# Altium schematic sheet 智能家居图纸2.SchDoc
size A4; SheetNumber: 2; SheetTotal: 2; SPICEModelCacheMWUIDHTT: <root> / <DocumentId>MWUIDHTT</DocumentId> / <CacheFrame Number="0"> / <Model Name="led0" Kind="MDL"> / <Text>*Typ INFRARED GaAs LED: Vf=1.2V Vr=5V If=40mA trr=3uS / *LED Pinout: 1=A, 2=K / .MODEL LED0 D (IS=93.5P RS=84M N=2.63 BV=5 IBV=10U / + CJO=2.97P VJ=.75 M=.333 TT=4.32U)</Text> / </Model> / <Model Name="led1" Kind="MDL"> / <Text>*Typ RED GaAs LED: Vf=1.7V Vr=4V If=40mA trr=3uS / *LED Pinout: 1=A, 2=K / .MODEL LED1 D (IS=93.2P RS=42M N=3.73 BV=4 IBV=10U / + CJO=2.97P VJ=.75 M=.333 TT=4.32U)</Text> / </Model> / <Model Name="led2" Kind="MDL"> / <Text>*Typ RED,GREEN,YELLOW,AMBER GaAs LED: Vf=2.1V Vr=4V If=40mA trr=3uS / *LED Pinout: 1=A, 2=K / .MODEL LED2 D (IS=93.1P RS=42M N=4.61 BV=4 IBV=10U / + CJO=2.97P VJ=.75 M=.333 TT=4.32U)</Text> / </Model> / <Model Name="led3" Kind="MDL"> / <Text>*Typ BLUE SiC LED: Vf=3.4V Vr=5V If=40mA trr=3uS / *LED Pinout: 1=A, 2=K / .MODEL LED3 D (IS=93.1P RS=42M N=7.47 BV=5 IBV=30U / + CJO=2.97P VJ=.75 M=.333 TT=4.32U)</Text> / </Model> / </CacheFrame> / </root>
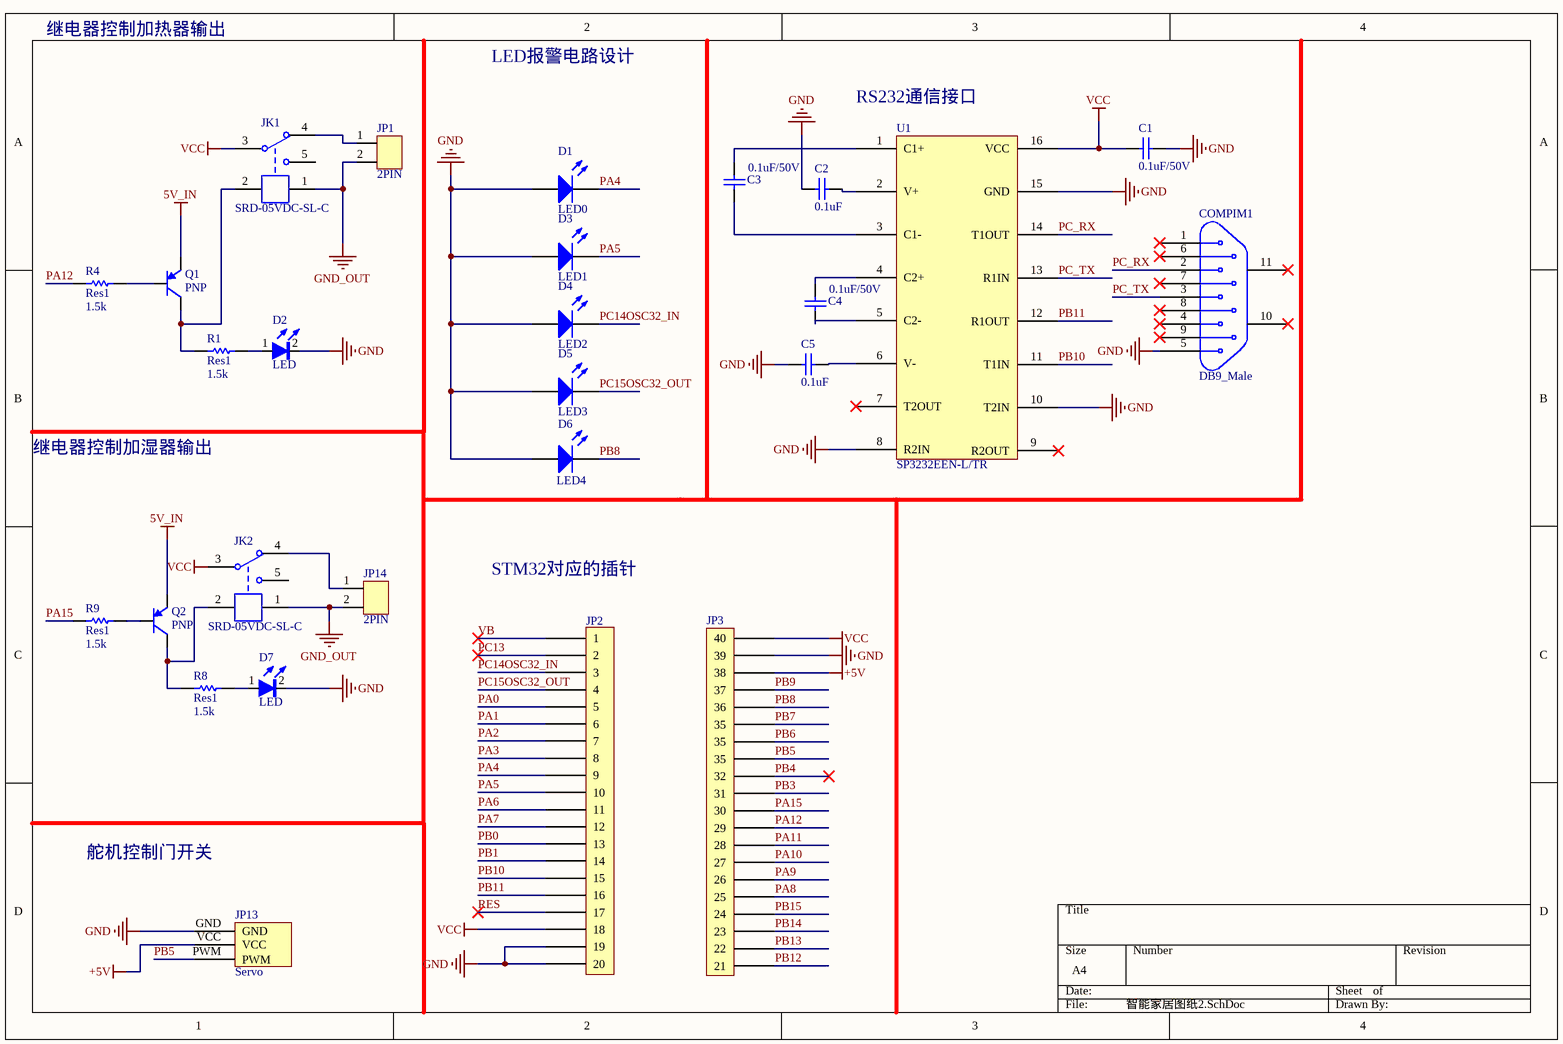
[diagram p0: 智能家居图纸2.SchDoc]

## Parts
C1  value 0.1uF/50V  [C0603]  (hidden comment: Cap)
C2  value 0.1uF  [C0603]  (hidden comment: Cap)
C3  value 0.1uF/50V  [C0603]  (hidden comment: Cap)
C4  value 0.1uF/50V  [C0603]  (hidden comment: Cap)
C5  value 0.1uF  [C0603]  (hidden comment: Cap)
COMPIM1  DB9_Male  [DB9Male]
D1  LED0  [LED-Green]
D2  LED  [LED-Green]
D3  LED1  [LED-Red]
D4  LED2  [LED-White]
D5  LED3  [LED-yellow]
D6  LED4  [LED-yellow]
D7  LED  [LED-Red]
JK1  SRD-05VDC-SL-C  [SRD-C_B]
JK2  SRD-05VDC-SL-C  [SRD-C_B]
JP1  2PIN  [2PIN]
JP2  JP3  [HDR1X20]  (value not drawn)
JP3  JP4  [HDR1X20-2]  (value not drawn)
JP13  Servo  [HDR1X3-5]
JP14  2PIN  [2PIN]
Q1  PNP  [PNP]
Q2  PNP  [PNP]
R1  Res1  value 1.5k  [R200]
R4  Res1  value 1.5k  [R200]
R8  Res1  value 1.5k  [R200]
R9  Res1  value 1.5k  [R200]
U1  SP3232EEN-L/TR  [SOP127P600X175-16N]

## Nets
5V_IN: Q1.3(E) Q2.3(E)
+5V: JP3.38 JP13.VCC
GND: C1.1 C2.1 C5.1 COMPIM1.5 D1.1(A) D2.2 D3.1(A) D4.1(A) D5.1(A) D6.1(A) D7.2 JP2.19 JP2.20 JP3.39 JP13.GND U1.8(R2IN) U1.10(T2IN) U1.15(GND)
GND_OUT: JK1.1 JK2.1 JP1.2 JP14.2
VCC: C1.2 JK1.3 JK2.3 JP2.18 JP3.40 U1.16(VCC)
PA0: JP2.5
PA1: JP2.6
PA2: JP2.7
PA3: JP2.8
PA4: D1.2(K) JP2.9
PA5: D3.2(K) JP2.10
PA6: JP2.11
PA7: JP2.12
PA8: JP3.25
PA9: JP3.26
PA10: JP3.27
PA11: JP3.28
PA12: JP3.29 R4.2
PA15: JP3.30 R9.2
PB0: JP2.13
PB1: JP2.14
PB3: JP3.31
PB4: JP3.32
PB5: JP3.33(35) JP13.PWM
PB6: JP3.34(35)
PB7: JP3.35
PB8: D6.2(K) JP3.36
PB9: JP3.37
PB10: JP2.15 U1.11(T1IN)
PB11: JP2.16 U1.12(R1OUT)
PB12: JP3.21
PB13: JP3.22
PB14: JP3.23
PB15: JP3.24
PC13: JP2.2
PC14OSC32_IN: D4.2(K) JP2.3
PC15OSC32_OUT: D5.2(K) JP2.4
PC_RX: COMPIM1.2 U1.14(T1OUT)
PC_TX: COMPIM1.3 U1.13(R1IN)
RES: JP2.17
VB: JP2.1
NetC2_2: C2.2 U1.2(V+)
NetC3_1: C3.1 U1.3(C1-)
NetC3_2: C3.2 U1.1(C1+)
NetC4_1: C4.1 U1.5(C2-)
NetC4_2: C4.2 U1.4(C2+)
NetC5_2: C5.2 U1.6(V-)
NetD2_1: D2.1 R1.2
NetD7_1: D7.1 R8.2
NetJK1_2: JK1.2 Q1.2(C) R1.1
NetJK1_4: JK1.4 JP1.1
NetJK2_2: JK2.2 Q2.2(C) R8.1
NetJK2_4: JK2.4 JP14.1
NetQ1_1: Q1.1(B) R4.1
NetQ2_1: Q2.1(B) R9.1

Not connected (* = marked no-connect by the designer): COMPIM1 1* 4* 6* 7* 8* 9* 10* 11*; JK1 5; JK2 5; U1 7(T2OUT)* 9(R2OUT)*

## Notes on the sheet
- 继电器控制加热器输出
- LED报警电路设计
- (near U1) RS232通信接口
- 继电器控制加湿器输出
- STM32对应的插针
- 舵机控制门开关

## Library data of the parts
C1-C5 = Cap: Capacitor; Published: 8-Jun-2000; LatestRevisionDate: 17-Jul-2002; LatestRevisionNote: Re-released for DXP Platform.; PackageReference: RAD-0.3; Publisher: Altium Limited; PackageDescription: Radial Cap, Thru-Hole; 2 Leads; 0.3 in Pin Spacing
COMPIM1 = DB9_Male: 9针串口线  RS232
D1 = LED0: Typical INFRARED GaAs LED; Published: 8-Jun-2000; LatestRevisionDate: 08-Jul-2005; LatestRevisionNote: Mech Layer 1 removed.; PackageReference: LED-0; Publisher: Altium Limited; PackageDescription: LED; 2 Leads
D2 D6 D7 = LED: 发光二极管
  D6: 技术支持，联系售后: https://shop463601444.taobao.com
D3 = LED1: Typical RED GaAs LED; Published: 8-Jun-2000; LatestRevisionDate: 08-Jul-2005; LatestRevisionNote: Mech Layer 1 removed.; PackageReference: LED-1; Publisher: Altium Limited; PackageDescription: LED; 2 Leads
D4 = LED2: Typical RED, GREEN, YELLOW, AMBER GaAs LED; Published: 8-Jun-2000; LatestRevisionDate: 17-Jul-2002; LatestRevisionNote: Re-released for DXP Platform.; PackageVersion: Feb-2002; PackageReference: 3.2X1.6X1.1; Publisher: Altium Limited; PackageDescription: SM LED; 2 Flat Leads
D5 = LED3: Typical BLUE SiC LED; Published: 8-Jun-2000; LatestRevisionDate: 17-Dec-2003; LatestRevisionNote: PCB Footprint replaced.; DatasheetVersion: 16-Apr-2002; PackageVersion: 16-Apr-2002; PackageReference: 3.5X2.8X1.9; Publisher: Altium Limited; PackageDescription: SM LED; 2 C-Bend Leads; Body 3.5 x 2.8 x 1.9 mm, inc leads (LxWxH typ)
JK1 JK2 = SRD-05VDC-SL-C: 5V一组转换; BOM名称: 5V继电器; 版权归属: 封装库来自淘宝卖家 ID：黄晶宝石; 学习资源: https://shop463601444.taobao.com
JP1 JP14 = JP: 插针
JP2 = JP3: STM32插针第一列
JP3 = JP4: STM32插针第二列
JP13 = Servo: 舵机
Q1 Q2 = 45H11: 互补功率-PNP型; 版权归属: 封装库来自淘宝 ID：黄晶宝石; 属性: 80V 8A 50W; BOM名称: 互补功率-PNP型; 技术支持，联系售后: https://shop463601444.taobao.com
R1 R4 R8 R9 = Res1: Resistor; Published: 8-Jun-2000; LatestRevisionDate: 17-Jul-2002; LatestRevisionNote: Re-released for DXP Platform.; PackageReference: AXIAL-0.3; Publisher: Altium Limited; PackageDescription: Axial Device, Thru-Hole; 2 Leads; 0.3 in Pin Spacing
U1 = SP3232EEN-L/TR: RS-232接口集成电路